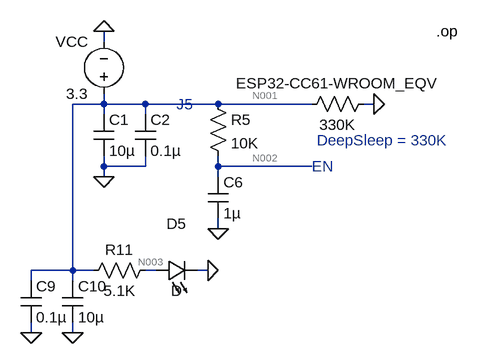
[diagram p0: schematic ESP32C61_DevKitc1v2.0_LTSpice.asc]
ESP32C61_DevKitc1v2.0_LTSpice.asc, the LTspice schematic file:
Version 4.1
SHEET 1 880 680
WIRE 192 32 192 16
WIRE 192 128 192 112
WIRE 192 128 144 128
WIRE 256 128 192 128
WIRE 368 128 256 128
WIRE 512 128 368 128
WIRE 608 128 592 128
WIRE 192 144 192 128
WIRE 256 144 256 128
WIRE 192 224 192 208
WIRE 256 224 256 208
WIRE 256 224 192 224
WIRE 368 224 368 208
WIRE 512 224 368 224
WIRE 192 240 192 224
WIRE 368 240 368 224
WIRE 368 320 368 304
WIRE 144 384 144 128
WIRE 144 384 80 384
WIRE 176 384 144 384
WIRE 272 384 256 384
WIRE 352 384 336 384
WIRE 80 400 80 384
WIRE 144 400 144 384
WIRE 80 480 80 464
WIRE 144 480 144 464
FLAG 192 240 0
FLAG 368 320 0
FLAG 608 128 0
FLAG 192 16 0
FLAG 352 384 0
FLAG 144 480 0
FLAG 80 480 0
SYMBOL voltage 192 128 R180
WINDOW 0 24 96 Left 2
WINDOW 3 24 16 Left 2
SYMATTR InstName VCC
SYMATTR Value 3.3
SYMBOL cap 176 144 R0
SYMATTR InstName C1
SYMATTR Value 10µ
SYMBOL cap 240 144 R0
SYMATTR InstName C2
SYMATTR Value 0.1µ
SYMBOL res 352 112 R0
SYMATTR InstName R5
SYMATTR Value 10K
SYMBOL res 608 112 R90
WINDOW 0 0 56 VBottom 2
WINDOW 3 32 56 VTop 2
SYMATTR InstName ESP32-CC61-WROOM_EQV
SYMATTR Value 330K
SYMBOL cap 352 240 R0
SYMATTR InstName C6
SYMATTR Value 1µ
SYMBOL res 272 368 R90
WINDOW 0 0 56 VBottom 2
WINDOW 3 32 56 VTop 2
SYMATTR InstName R11
SYMATTR Value 5.1K
SYMBOL LED 272 400 R270
WINDOW 0 72 32 VTop 2
WINDOW 3 0 32 VBottom 2
SYMATTR InstName D5
SYMBOL cap 128 400 R0
SYMATTR InstName C10
SYMATTR Value 10µ
SYMBOL cap 64 400 R0
SYMATTR InstName C9
SYMATTR Value 0.1µ
TEXT 304 128 Left 2 ;J5
TEXT 520 184 Left 2 ;DeepSleep = 330K
TEXT 512 224 Left 2 ;EN
TEXT 704 16 Left 2 !.op

The netlist it stands for:
* ESP32C61_DevKitc1v2.0_LTSpice.asc
VCC N001 0 3.3
C1 N001 0 10µ
C2 N001 0 0.1µ
R5 N001 N002 10K
R§ESP32-CC61-WROOM_EQV 0 N001 330K
C6 N002 0 1µ
R11 N003 N001 5.1K
D5 N003 0 D
C10 N001 0 10µ
C9 N001 0 0.1µ
.model D D
.lib standard.dio
* J5
* DeepSleep = 330K
* EN
.op
.backanno
.end

* Results of the author's LTspice run, read from the files saved beside the schematic
* Operating Point:
*   V(n001) = 3.3 V
*   V(n002) = 3.3 V
*   V(n003) = 638.3 mV
*   I(C1) = 0 A
*   I(C10) = 0 A
*   I(C2) = 0 A
*   I(C6) = 0 A
*   I(C9) = 0 A
*   I(D5) = 521.9 µA
*   I(ESP32-CC61-WROOM_EQV) = -10 µA
*   I(R11) = -521.9 µA
*   I(R5) = 0 A
*   I(VCC) = -531.9 µA